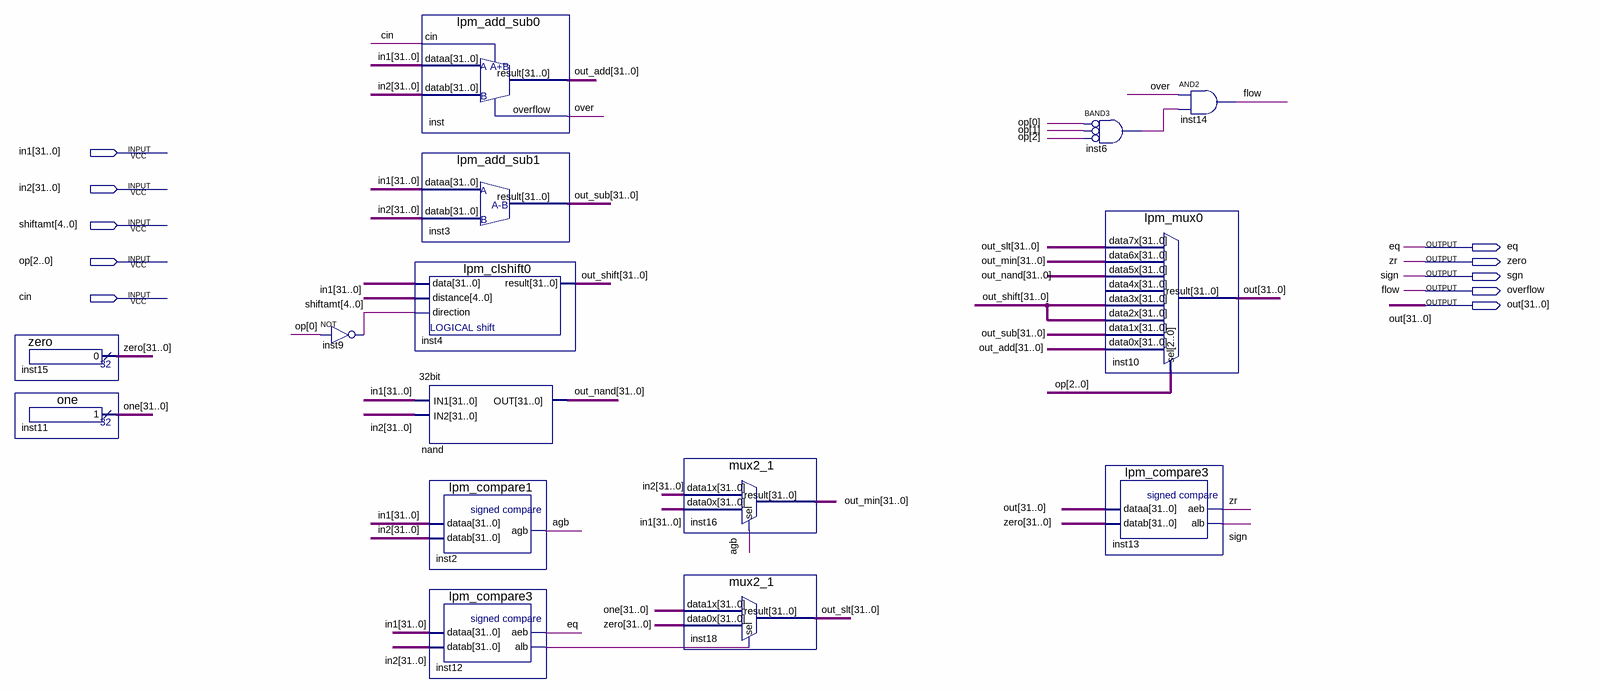
[diagram p0: schematic sheet]
// Quartus schematic ALU.bdf as structural Verilog: 15 symbols, 10 pins
module ALU (
  input  [31:0] in1,
  input  [31:0] in2,
  input  [4:0] shiftamt,
  input  [2:0] op,
  input  cin,
  output eq,
  output zero,
  output sgn,
  output overflow,
  output [31:0] out
);

  wire agb, inst6_out, inst9_out, inst12_alb, over;
  wire [31:0] one, out_add, out_min, out_nand, out_shift, out_slt, out_sub, zero_bus;

  zero inst15 (.result(zero_bus));
  one inst11 (.result(one));
  not inst9 (inst9_out, op[0]);
  lpm_add_sub0 inst (.cin(cin), .dataa(in1), .datab(in2), .result(out_add), .overflow(over));
  lpm_add_sub1 inst3 (.dataa(in1), .datab(in2), .result(out_sub));
  lpm_clshift0 inst4 (.data(in1), .distance(shiftamt), .direction(inst9_out), .result(out_shift));
  \32bit  \nand  (.IN1(in1), .IN2(in2), .OUT(out_nand));
  lpm_compare1 inst2 (.dataa(in1), .datab(in2), .agb(agb));
  lpm_compare3 inst12 (.dataa(in1), .datab(in2), .aeb(eq), .alb(inst12_alb));
  mux2_1 inst16 (.data1x(in2), .data0x(in1), .sel(agb), .result(out_min));
  mux2_1 inst18 (.data1x(one), .data0x(zero_bus), .sel(inst12_alb), .result(out_slt));
  and inst6 (inst6_out, ~op[0], ~op[1], ~op[2]);  // BAND3
  lpm_mux0 inst10 (
    .data7x(out_slt), .data6x(out_min), .data5x(out_nand), .data3x(out_shift), .data2x(out_shift),
    .data1x(out_sub), .data0x(out_add), .sel(op), .result(out));  // open: data4x
  lpm_compare3 inst13 (.dataa(out), .datab(zero_bus), .aeb(zero), .alb(sgn));
  and inst14 (overflow, over, inst6_out);

  // Other names for the same wires on the sheet: flow = overflow; sign = sgn; zr = zero
endmodule
